# EAGLE design sensors (EAGLE 6.2)
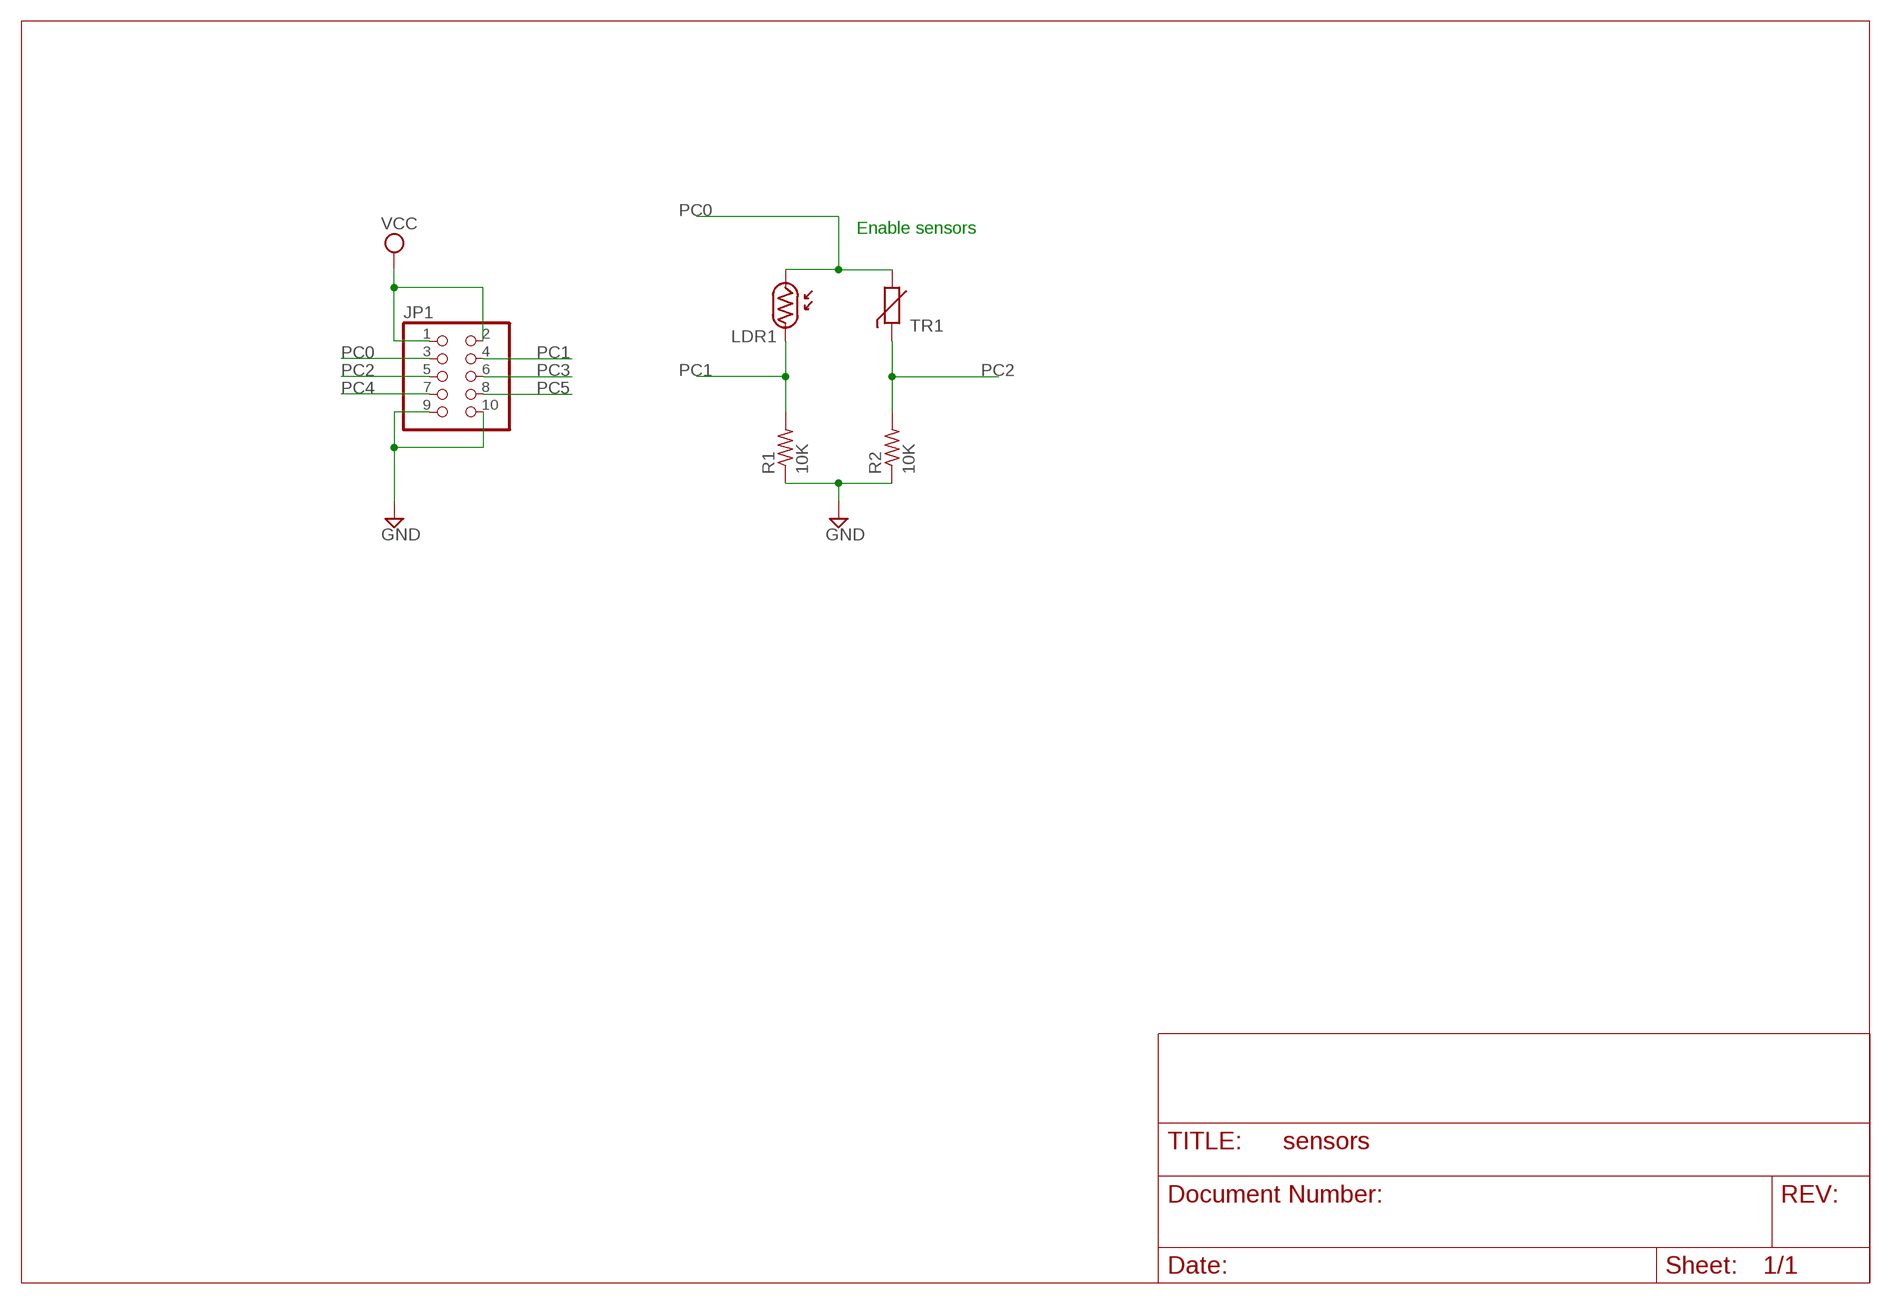
[diagram p0: schematic, sheet 1]

## Parts
JP1  PINHD-2X5  [2X05]
LDR1  LDR  [3MM]
R1  10K  R-US_0204/5  [0204/5]
R2  10K  R-US_0204/5  [0204/5]
TR1  THERMISTOR_R-5  [R-5]

## Nets
GND: JP1.9 JP1.10 R1.1 R2.1
PC0: JP1.3 LDR1.P$1 TR1.2
PC1: JP1.4 LDR1.P$2 R1.2
PC2: JP1.5 R2.2 TR1.1
PC3: JP1.6
PC4: JP1.7
PC5: JP1.8
VCC: JP1.1 JP1.2

## Notes on the sheet
- Enable sensors

## Library data of the parts
JP1 = pinhead:PINHD-2X5: PIN HEADER
LDR1 = ldr:LDR
R1 R2 = rcl:R-US_: RESISTOR, American symbol
TR1 = discrete:THERMISTOR_: Thermo Resistor

## Board
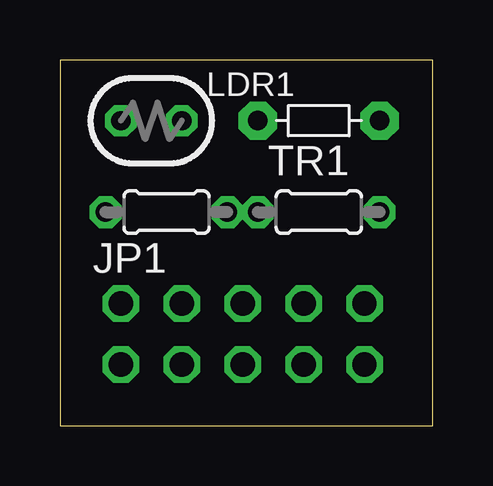
[diagram p1: board, top side]
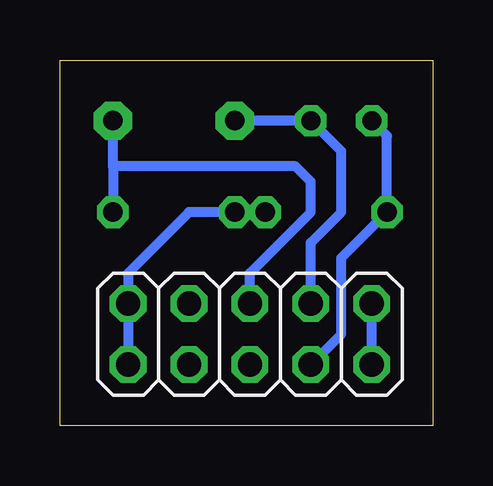
[diagram p2: board, bottom side, seen from below]

Size 15.54 x 15.23 mm. Coordinates in mm from the lower left corner, seen from the top.
Outline: 0,0 15.54,0 15.54,15.23 0,15.23 0,0
Copper layers (1*16): Top 0.035mm / dielectric 1.5mm / Bottom 0.035mm
Design rules: minimum track width 16mil, minimum drill 24mil, track to track 8mil, track to pad 8mil, pad to pad 8mil, via to via 8mil, smd to smd 8mil, copper to edge 40mil, drill to drill 8mil, minimum pad ring 10mil, minimum via ring 8mil, stop-mask expansion 4mil, vias tented up to drill 0mil, thermal gap 10mil

### Footprints (pad centres in the part's own frame; a part is rotated, then mirrored left to right if it is on the bottom)
2X05 = drill 1.016 octagon: 1 -5.08,-1.27; 2 -5.08,1.27; 3 -2.54,-1.27; 4 -2.54,1.27; 5 0,-1.27; 6 0,1.27; 7 2.54,-1.27; 8 2.54,1.27; 9 5.08,-1.27; 10 5.08,1.27
3MM = drill 0.8 octagon: P$1 0,0; P$2 2.54,0
0204/5 = drill 0.813 octagon: 1 -2.54,0; 2 2.54,0
R-5 = drill 0.813 pad 1.6 octagon: 1 -2.54,0; 2 2.54,0

### Placement (x,y rotation side)
JP1  7.62,3.81 180 bottom
LDR1  5.08,12.7 180 top
R1  4.45,8.89 180 top
R2  10.79,8.89 0 top
TR1  10.79,12.7 180 top

### Tracks (layer width: path | path; a pad name or v marks a point on that pad's centre or on a via)
GND
  Bottom 0.406: R1.1 R2.1 10.16,8.89 12.7,6.35 JP1.9 JP1.10
PC0
  Bottom 0.406: JP1.3 5.08,7.62 3.81,8.89 3.81,11.43 LDR1.P$1 TR1.2
PC1
  Bottom 0.406: JP1.4 3.81,3.81 3.81,6.99 R1.2 1.91,12.06 LDR1.P$2
PC2
  Bottom 0.406: JP1.5 7.62,6.35 5.08,8.89 5.08,10.16 5.71,10.79 13.34,10.79 | 13.34,10.79 R2.2 | 13.34,10.79 TR1.1
VCC
  Bottom 0.406: JP1.2 JP1.1